# EAGLE design motor6 (EAGLE 6.1)

## Sheet 1 of 3
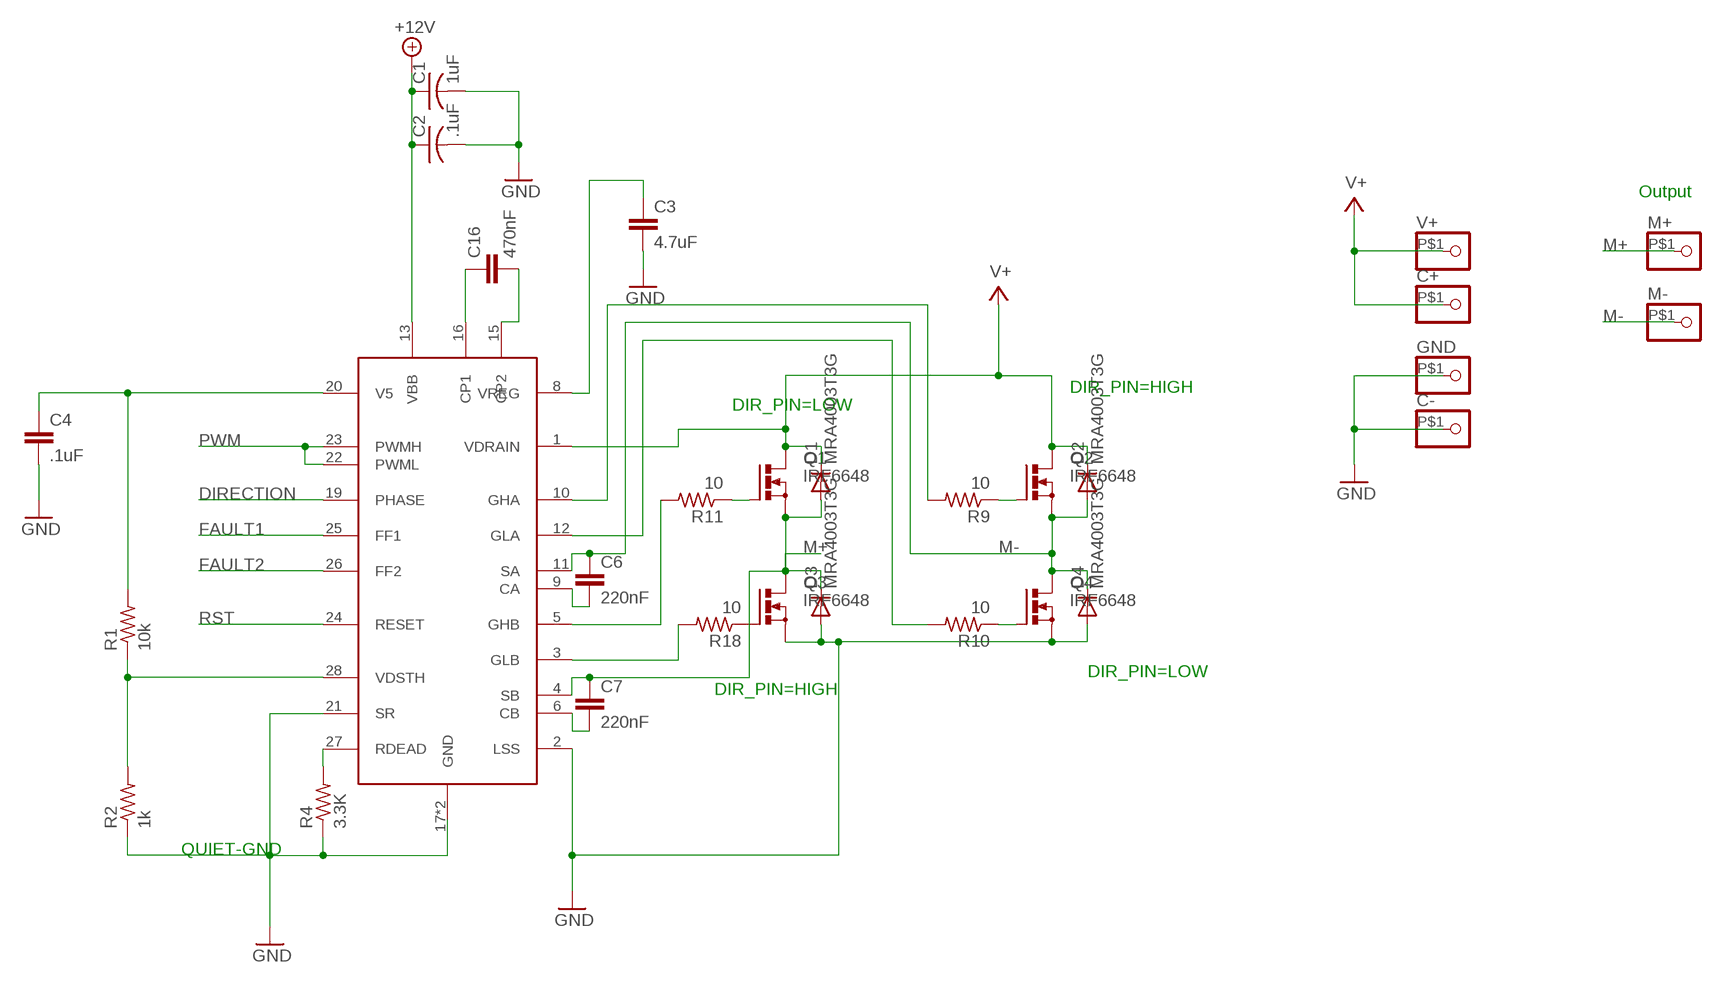
[diagram p0: schematic, sheet 1]

### Parts
ALLGR  ALLEGRO-A3921  [TSSOP28]
C1  1uF  C-USC0603  [C0603]
C2  .1uF  C-USC0603  [C0603]
C3  4.7uF  C-EUC0603  [C0603]
C4  .1uF  C-EUC0603  [C0603]
C6  220nF  C-EUC0603  [C0603]
C7  220nF  C-EUC0603  [C0603]
C16  470nF  C-EUC0603  [C0603]
C+  PINHD-1X1  [1X01]
C-  PINHD-1X1  [1X01]
D1  MRA4003T3G  [SMA]
D2  MRA4003T3G  [SMA]
D3  MRA4003T3G  [SMA]
D4  MRA4003T3G  [SMA]
GND  PINHD-1X1  [1X01]
M+  PINHD-1X1  [1X01]
M-  PINHD-1X1  [1X01]
Q1  IRF6648  [DIRECTFET-MOD]
Q2  IRF6648  [DIRECTFET-MOD]
Q3  IRF6648  [DIRECTFET]
Q4  IRF6648  [DIRECTFET]
R1  10k  R-US_R0603  [R0603]
R2  1k  R-US_R0603  [R0603]
R4  3.3K  R-US_R0603  [R0603]
R9  10  R-US_R0603  [R0603]
R10  10  R-US_R0603  [R0603]
R11  10  R-US_R0603  [R0603]
R18  10  R-US_R0603  [R0603]
V+  PINHD-1X1  [1X01]

### Nets
+5V-A: ALLGR.20(V5) C4.1 R1.2
+12V: ALLGR.13(VBB) C1.1 C2.1 ; also sheet 3
+48V: ALLGR.1(VDRAIN) C+.P$1 D1.C D2.C Q1.D@1(D) Q1.D@2(D) Q1.D@3(D) Q1.D@4(D) Q2.D@1(D) Q2.D@2(D) Q2.D@3(D) Q2.D@4(D) V+.P$1 ; supply symbol labelled V+ ; also sheet 3
DIRECTION: ALLGR.19(PHASE) ; also sheet 2
FAULT1: ALLGR.25(FF1) ; also sheet 2
FAULT2: ALLGR.26(FF2) ; also sheet 2
GND: ALLGR.2(LSS) ALLGR.17(GND) ALLGR.21(SR) ALLGR.P$1(GND) C1.2 C2.2 C3.2 C4.2 C-.P$1 D3.A D4.A GND.P$1 Q3.S@1(S) Q3.S@2(S) Q4.S@1(S) Q4.S@2(S) R2.1 R4.1 ; also sheet 2,3
M+: ALLGR.4(SB) C7.1 D1.A D3.C M+.P$1 Q1.S@1(S) Q1.S@2(S) Q3.D@1(D) Q3.D@2(D) Q3.D@3(D) Q3.D@4(D)
M-: ALLGR.11(SA) C6.1 D2.A D4.C M-.P$1 Q2.S@1(S) Q2.S@2(S) Q4.D@1(D) Q4.D@2(D) Q4.D@3(D) Q4.D@4(D)
N$1: ALLGR.8(VREG) C3.1
N$2: ALLGR.16(CP1) C16.1
N$3: ALLGR.15(CP2) C16.2
N$4: ALLGR.10(GHA) R9.2
N$6: ALLGR.5(GHB) R11.2
N$7: Q1.G R11.1
N$11: ALLGR.6(CB) C7.2
N$12: ALLGR.9(CA) C6.2
N$13: ALLGR.28(VDSTH) R1.1 R2.2
N$20: ALLGR.27(RDEAD) R4.2
N$21: Q3.G R18.1
N$29: Q2.G R9.1
N$30: Q4.G R10.1
N$31: ALLGR.12(GLA) R10.2
N$32: ALLGR.3(GLB) R18.2
PWM: ALLGR.22(PWML) ALLGR.23(PWMH) ; also sheet 2
RST: ALLGR.24(RESET) ; also sheet 2

### Notes on the sheet
- Output
- DIR_PIN=HIGH
- DIR_PIN=LOW
- DIR_PIN=LOW
- DIR_PIN=HIGH
- QUIET-GND

## Sheet 2 of 3
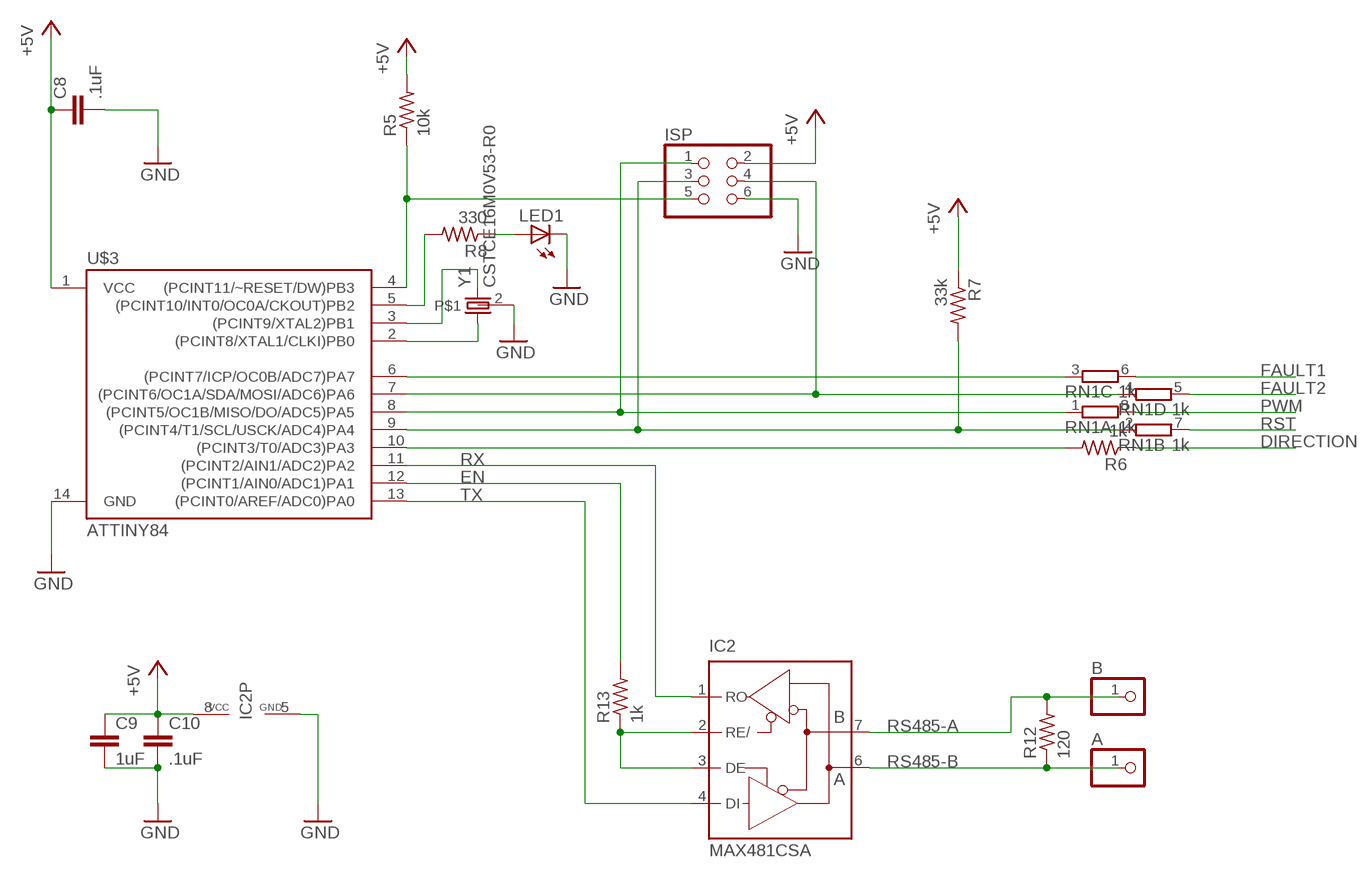
[diagram p1: schematic, sheet 2]

### Parts
A  PINHD-1X1  [1X01]
B  PINHD-1X1  [1X01]
C8  .1uF  C-EUC0603  [C0603]
C9  1uF  C-EUC0603  [C0603]
C10  .1uF  C-EUC0603  [C0603]
IC2  MAX481CSA  [SO08]
ISP  PINHD-2X3  [2X03]
LED1  LEDCHIPLED_0603  [CHIPLED_0603]
R5  10k  R-US_R0603  [R0603]
R6  1k  R-US_R0603  [R0603]
R7  33k  R-US_R0603  [R0603]
R8  330  R-US_R0603  [R0603]
R12  120  R-US_R0603  [R0603]
R13  1k  R-US_R0603  [R0603]
RN1  1k  4R-NEXB38V  [EXB38V]
U$3  ATTINY84  [SO14]
Y1  CSTCE16M0V53-R0  [MYSMD2_RESONATOR]

### Nets
+5V: C8.1 C9.1 C10.1 IC2.8(VCC) ISP.2 R5.2 R7.1 U$3.1(VCC) ; also sheet 3
DIRECTION: R6.1 ; also sheet 1
EN: R13.2 U$3.12((PCINT1/AIN0/ADC1)PA1)
FAULT1: RN1.6 ; also sheet 1
FAULT2: RN1.5 ; also sheet 1
GND: C8.2 C9.2 C10.2 IC2.5(GND) ISP.6 LED1.C U$3.14(GND) Y1.2 ; also sheet 1,3
N$5: ISP.1 RN1.1 U$3.8((PCINT5/OC1B/MISO/DO/ADC5)PA5)
N$8: ISP.4 RN1.4 U$3.7((PCINT6/OC1A/SDA/MOSI/ADC6)PA6)
N$14: IC2.2(RE/) IC2.3(DE) R13.1
N$16: U$3.2((PCINT8/XTAL1/CLKI)PB0) Y1.1
N$18: RN1.3 U$3.6((PCINT7/ICP/OC0B/ADC7)PA7)
N$19: R6.2 U$3.10((PCINT3/T0/ADC3)PA3)
N$24: U$3.3((PCINT9/XTAL2)PB1) Y1.3
N$26: LED1.A R8.1
N$28: R8.2 U$3.5((PCINT10/INT0/OC0A/CKOUT)PB2)
N$33: ISP.5 R5.1 U$3.4((PCINT11/~RESET/DW)PB3)
OIJWOIJ3: ISP.3 R7.2 RN1.2 U$3.9((PCINT4/T1/SCL/USCK/ADC4)PA4)
PWM: RN1.8 ; also sheet 1
RS485-A: B.1 IC2.7(B) R12.2
RS485-B: A.1 IC2.6(A) R12.1
RST: RN1.7 ; also sheet 1
RX: IC2.1(RO) U$3.11((PCINT2/AIN1/ADC2)PA2)
TX: IC2.4(DI) U$3.13((PCINT0/AREF/ADC0)PA0)

## Sheet 3 of 3
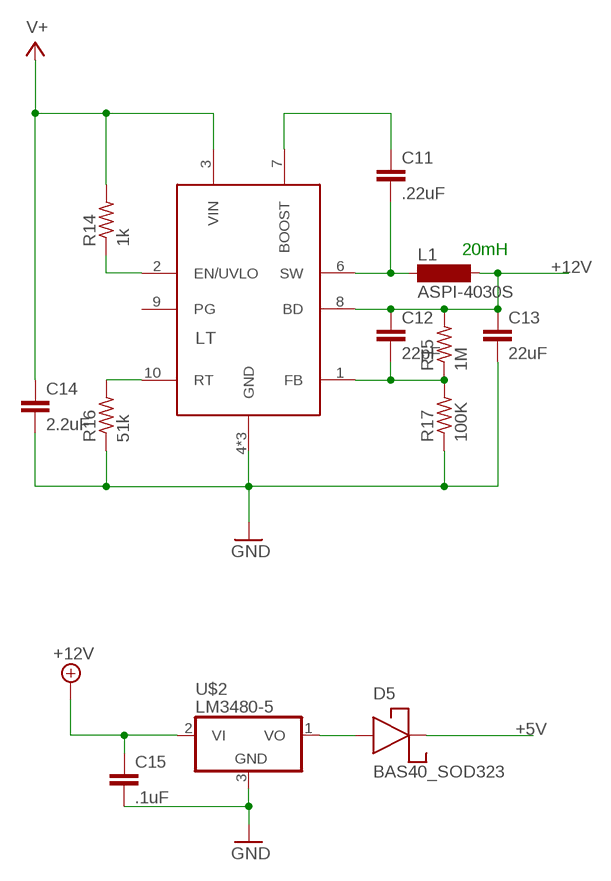
[diagram p2: schematic, sheet 3]

### Parts
C11  .22uF  C-EUC0603  [C0603]
C12  22pF  C-EUC0603  [C0603]
C13  22uF  C-EUC0805  [C0805]
C14  2.2uF  C-EUC0603  [C0603]
C15  .1uF  C-EUC0603  [C0603]
D5  BAS40_SOD323  [SOD323]
L1  ASPI-4030S  [ASPI-4030S]
LT  LT3990  [DFN10-3X3]
R14  1k  R-US_R0603  [R0603]
R15  1M  R-US_R0603  [R0603]
R16  51k  R-US_R0603  [R0603]
R17  100K  R-US_R0603  [R0603]
U$2  LM3480-5  [SOT23]

### Nets
+5V: D5.1 ; also sheet 2
+12V: C12.1 C13.1 C15.1 L1.P$2 LT.8(BD) R15.2 U$2.2(VI) ; also sheet 1
+48V: C14.1 LT.3(VIN) R14.2 ; supply symbol labelled V+ ; also sheet 1
GND: C13.2 C14.2 C15.2 LT.4(GND) LT.5(GND) LT.EXP(GND) R16.1 R17.1 U$2.3(GND) ; also sheet 1,2
N$10: C11.1 LT.7(BOOST)
N$15: C11.2 L1.P$1 LT.6(SW)
N$17: C12.2 LT.1(FB) R15.1 R17.2
N$22: LT.10(RT) R16.2
N$25: D5.2 U$2.1(VO)
N$27: LT.2(EN/UVLO) R14.1
Unconnected: LT.9(PG)

### Notes on the sheet
- 20mH

## Library data of the parts
A B = pinhead:PINHD-1X1: PIN HEADER
ALLGR = evan:ALLEGRO-A3921: Allegro A3921 Automotive Full Bridge Mosfet Driver
C1 C2 = rcl:C-US: CAPACITOR, American symbol
C3 C4 C6-C16 = rcl:C-EU: CAPACITOR, European symbol
C+ C- GND M+ M- V+ = evan:PINHD-1X1: PIN HEADER
D1-D4 = evan:MRA4003T3G
D5 = evan:BAS40_SOD323
IC2 = maxim:MAX481CSA: RS485 TRANSEIVER; MF: MAXIM; MPN: MAX481CSA; OC_FARNELL: unknown; OC_NEWARK: 90C3817
ISP = pinhead:PINHD-2X3: PIN HEADER
L1 = evan:ASPI-4030S
LED1 = led:LED: LED OSRAM: - CHIPLED LG R971, LG N971, LY N971, LG Q971, LY Q971, LO R971, LY R971 LH N974, LH R974 LS Q976, LO Q976, LY Q976 LO Q996 - Hyper CHIPLED LW Q18S LB Q993, LB Q99A, LB R99A - SideLED LS A670, LO A670, LY A670, LG A670, LP A670 LB A673, LV A673, LT A673, LW A673 LH A674 LY A675 LS A676, LA A676, LO A676, LY A676, LW A676 LS A679, LY A679, LG A679 - Hyper Micro SIDELED® LS Y876, LA Y876, LO Y876, LY Y876 LT Y87S - SmartLED LW L88C, LW L88S LB L89C, LB L89S, LG L890 LS L89K, LO L89K, LY L89K LS L896, LA L896, LO L896, LY L896 - TOPLED LS T670, LO T670, LY T670, LG T670, LP T670 LSG T670, LSP T670, LSY T670, LOP T670, LYG T670 LG T671, LOG T671, LSG T671 LB T673, LV T673, LT T673, LW T673 LH T674 LS T676, LA T676, LO T676, LY T676, LB T676, LH T676, LSB T676, LW T676 LB T67C, LV T67C, LT T67C, LS T67K, LO T67K, LY T67K, LW E67C LS E67B, LA E67B, LO E67B, LY E67B, LB E67C, LV E67C, LT E67C LW T67C LS T679, LY T679, LG T679 LS T770, LO T770, LY T770, LG T770, LP T770 LB T773, LV T773, LT T773, LW T773 LH T774 LS E675, LA E675, LY E675, LS T675 LS T776, LA T776, LO T776, LY T776, LB T776 LHGB T686 LT T68C, LB T68C - Hyper Mini TOPLED® LB M676 - Mini TOPLED Santana® LG M470 LS M47K, LO M47K, LY M47K Source: http://www.osram.convergy.de LUXEON: - LUMILED® LXK2-PW12-R00, LXK2-PW12-S00, LXK2-PW14-U00, LXK2-PW14-V00 LXK2-PM12-R00, LXK2-PM12-S00, LXK2-PM14-U00 LXK2-PE12-Q00, LXK2-PE12-R00, LXK2-PE12-S00, LXK2-PE14-T00, LXK2-PE14-U00 LXK2-PB12-K00, LXK2-PB12-L00, LXK2-PB12-M00, LXK2-PB14-N00, LXK2-PB14-P00, LXK2-PB14-Q00 LXK2-PR12-L00, LXK2-PR12-M00, LXK2-PR14-Q00, LXK2-PR14-R00 LXK2-PD12-Q00, LXK2-PD12-R00, LXK2-PD12-S00 LXK2-PH12-R00, LXK2-PH12-S00 LXK2-PL12-P00, LXK2-PL12-Q00, LXK2-PL12-R00 Source: www.luxeon.com KINGBRIGHT: KA-3528ASYC Source: www.kingbright.com
LT = evan:LT3990: http://cds.linear.com/docs/en/datasheet/3990fa.pdf
Q1 Q2 = evan:IRF6648: DirectFET Power MOSFET Source: http://www.irf.com/product-info/datasheets/data/irf6648.pdf
Q3 Q4 = transistor-power:IRF6648: DirectFET Power MOSFET Source: http://www.irf.com/product-info/datasheets/data/irf6648.pdf
R1 R2 R4-R18 = rcl:R-US_: RESISTOR, American symbol
RN1 = resistor-dil:4R-N: Array Chip Resistor Source: RS Component / Phycomp; OC_FARNELL: unknown; OC_NEWARK: unknown
U$2 = evan:LM3480-5
U$3 = evan:ATTINY84: Atmel 14-pin 2/4/8kB flash uC
Y1 = evan:CSTCE16M0V53-R0

## Board
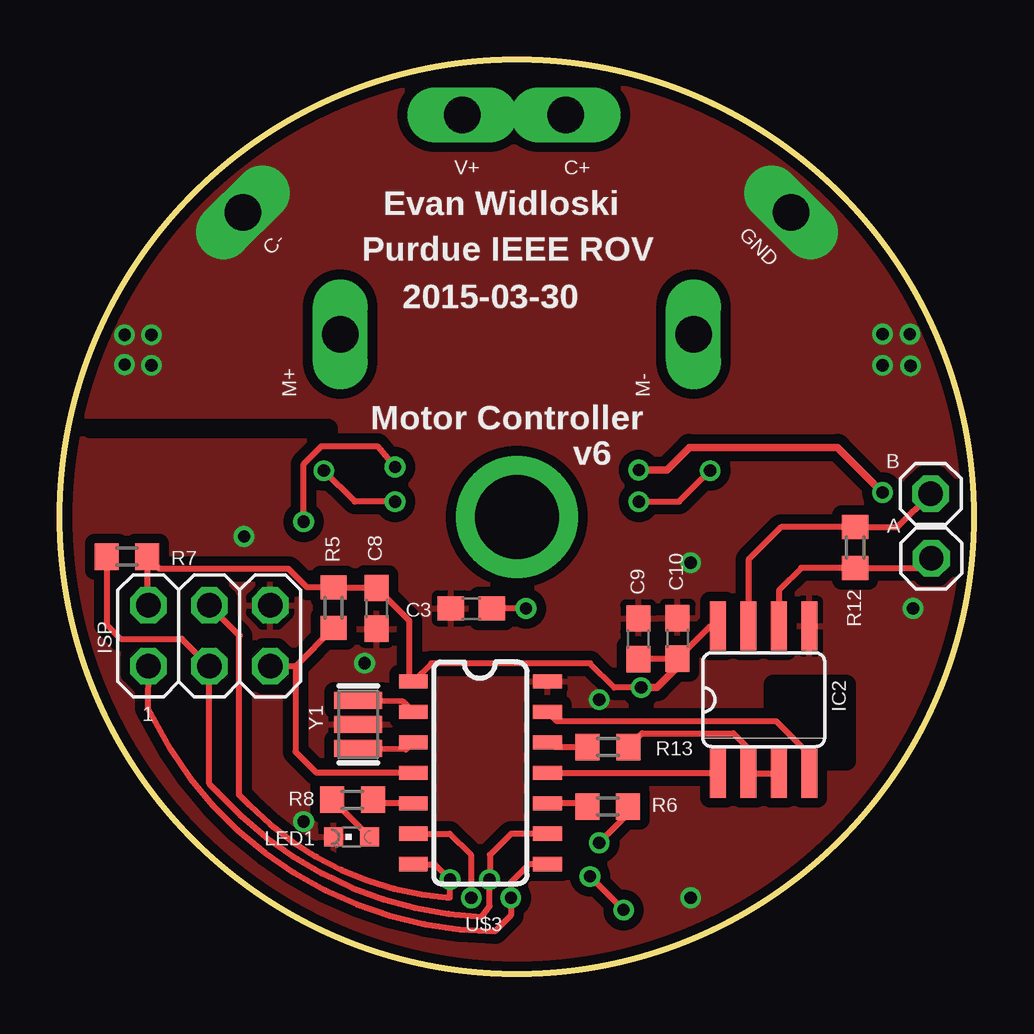
[diagram p3: board, top side]
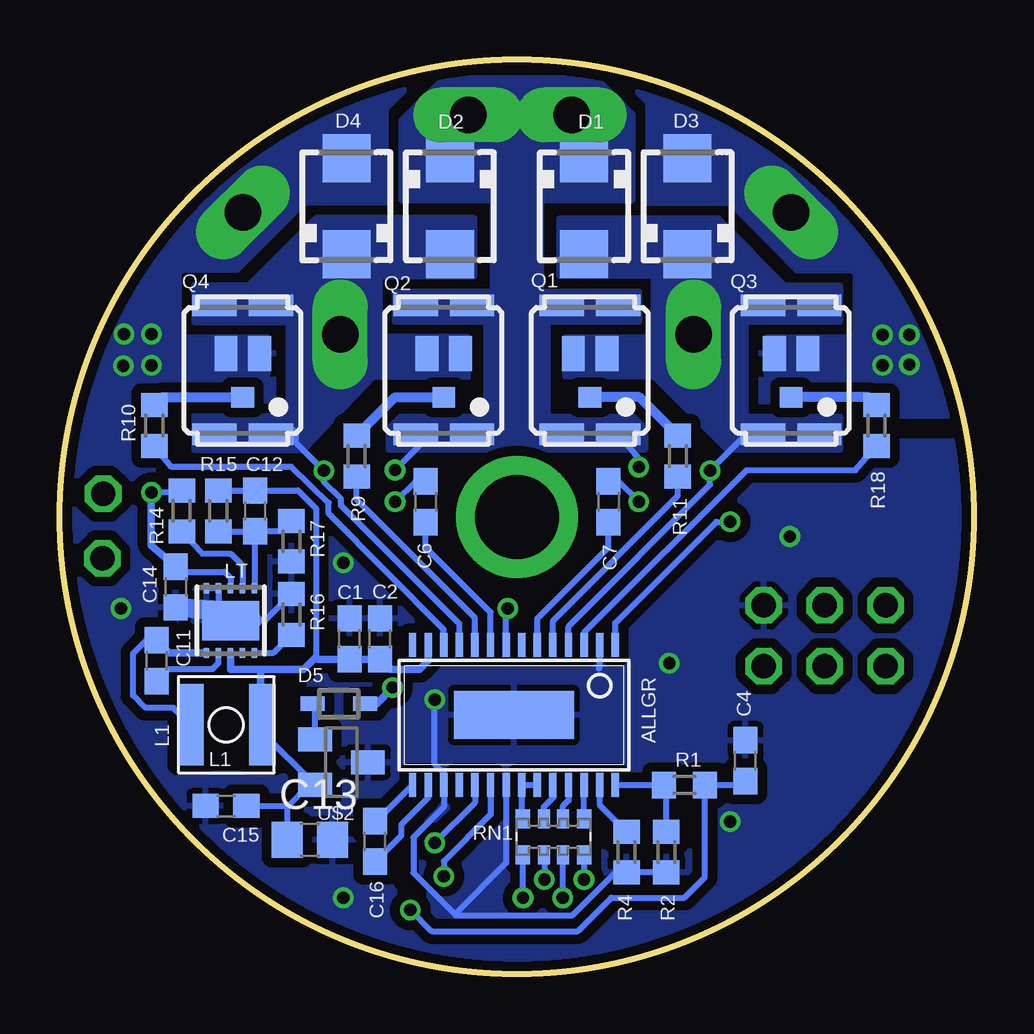
[diagram p4: board, bottom side, seen from below]

Size 38.1 x 38.1 mm. Coordinates in mm from the lower left corner, seen from the top.
Outline: circle at 19.05,19.05 radius 19.05
Copper layers (1*16): Top 0.0356mm / dielectric 1.5011mm / Bottom 0.0356mm
Design rules: minimum track width 6mil, minimum drill 13mil, track to track 6mil, track to pad 6mil, pad to pad 6mil, via to via 6mil, smd to smd 6mil, copper to edge 15mil, drill to drill 6mil, minimum pad ring 7mil, minimum via ring 7mil, stop-mask expansion 3mil, vias tented up to drill 0mil, thermal gap 10mil
tRestrict: area 29.7,8.9 to 32.8,12.1; 1 lines
bRestrict: area 29.7,8.9 to 32.8,12.1; 3 lines

### Footprints (pad centres in the part's own frame; a part is rotated, then mirrored left to right if it is on the bottom)
1X01 = drill 1.016 octagon: 1 0,0
TSSOP28 = smd 0.305 x 0.991: 1 -4.225,-2.918; 2 -3.575,-2.918; 3 -2.925,-2.918; 4 -2.275,-2.918; 5 -1.625,-2.918; 6 -0.975,-2.918; 7 -0.325,-2.918; 8 0.325,-2.918; 9 0.975,-2.918; 10 1.625,-2.918; 11 2.275,-2.918; 12 2.925,-2.918; 13 3.575,-2.918; 14 4.225,-2.918; 15 4.225,2.918; 16 3.575,2.918; 17 2.925,2.918; 18 2.275,2.918; 19 1.625,2.918; 20 0.975,2.918; 21 0.325,2.918; 22 -0.325,2.918; 23 -0.975,2.918; 24 -1.625,2.918; 25 -2.275,2.918; 26 -2.925,2.918; 27 -3.575,2.918; 28 -4.225,2.918 | smd 5 x 2: P$1 0,0
C0603 = smd 1.1 x 1: 1 -0.85,0; 2 0.85,0
C0805 = smd 1.3 x 1.5: 1 -0.95,0; 2 0.95,0
1X01' = drill 1.524 pad 1.676 long: P$1 0,0
SMA = smd 2 x 2: A 2,0; C -2,0
SOD323 = smd 1 x 0.6: 1 -1.1,0; 2 1.1,0
SO08 = smd 0.66 x 2.032: 1 -1.905,-3.073; 2 -0.635,-3.073; 3 0.635,-3.073; 4 1.905,-3.073; 5 1.905,3.073; 6 0.635,3.073; 7 -0.635,3.073; 8 -1.905,3.073
2X03 = drill 1.016 octagon: 1 -2.54,-1.27; 2 -2.54,1.27; 3 0,-1.27; 4 0,1.27; 5 2.54,-1.27; 6 2.54,1.27
ASPI-4030S = smd 1.1 x 3.4: P$1 -1.5,0; P$2 1.5,0
CHIPLED_0603 = smd 0.8 x 0.8: A 0,-0.75; C 0,0.75
DFN10-3X3 = smd 0.25 x 0.45: 1 -1,-1.35; 2 -0.5,-1.35; 3 0,-1.35; 4 0.5,-1.35; 5 1,-1.35; 6 1,1.35; 7 0.5,1.35; 8 0,1.35; 9 -0.5,1.35; 10 -1,1.35 | smd 2.38 x 1.65: EXP 0,0
DIRECTFET-MOD = smd 0.9 x 1.85: D@1 -2.656,1.176; D@2 -2.656,-1.174; D@3 2.724,1.176; D@4 2.724,-1.174 | smd 0.85 x 0.95: G -1.101,0.002 | smd 1.45 x 0.95: S@1 0.719,0.701; S@2 0.719,-0.699
R0603 = smd 1 x 1.1: 1 -0.85,0; 2 0.85,0
EXB38V = smd 0.6 x 0.8: 1 -1.275,-0.75; 4 1.275,-0.75; 5 1.275,0.75; 8 -1.275,0.75 | smd 0.5 x 0.8: 2 -0.4,-0.75; 3 0.4,-0.75; 6 0.4,0.75; 7 -0.4,0.75
SOT23 = smd 1 x 1.4: 1 -0.95,-1.1; 2 0.95,-1.1; 3 0,1.1
SO14 = smd 0.6 x 1.2: 1 -3.81,-2.8; 2 -2.54,-2.8; 3 -1.27,-2.8; 4 0,-2.8; 5 1.27,-2.8; 6 2.54,-2.8; 7 3.81,-2.8; 8 3.81,2.8; 9 2.54,2.8; 10 1.27,2.8; 11 0,2.8; 12 -1.27,2.8; 13 -2.54,2.8; 14 -3.81,2.8
MYSMD2_RESONATOR = smd 0.7 x 2: 1 -1,0; 2 0,0; 3 1,0

### Placement (x,y rotation side)
A  36.32,17.32 0 top
ALLGR  19.18,10.79 180 bottom
B  36.3,20.02 0 top
C1  26.04,13.97 90 bottom
C2  24.77,13.97 90 bottom
C3  17.14,15.24 180 top
C4  9.53,8.89 90 bottom
C6  22.86,19.69 270 bottom
C7  15.24,19.69 270 bottom
C8  13.19,15.24 270 top
C9  24.11,13.97 90 top
C10  25.75,13.99 90 top
C11  34.06,13.06 90 bottom
C12  29.97,19.3 270 bottom
C13  27.69,5.59 0 bottom
C14  33.27,16.13 270 bottom
C15  31.18,7 180 bottom
C16  24.96,5.53 90 bottom
C+  [1X01']  21.08,35.81 0 top
C-  [1X01']  7.62,31.75 45 top
D1  16.26,32 270 bottom
D2  21.84,32 270 bottom
D3  11.94,32 90 bottom
D4  26.16,32 90 bottom
D5  26.48,11.26 180 bottom
GND  [1X01']  30.48,31.75 135 top
IC2  29.34,11.43 0 top
ISP  6.22,14.1 0 top
L1  31.17,10.39 0 bottom
LED1  12.15,5.71 90 top
LT  30.99,14.73 180 bottom
M+  [1X01']  11.68,26.67 90 top
M-  [1X01']  26.42,26.67 90 top
Q1  16,25.15 90 bottom
Q2  22.1,25.15 90 bottom
Q3  IRF6648  [DIRECTFET-MOD]  7.62,25.15 90 bottom
Q4  IRF6648  [DIRECTFET-MOD]  30.48,25.15 90 bottom
R1  12.07,7.87 0 bottom
R2  12.83,5.08 90 bottom
R4  14.48,5.08 90 bottom
R5  11.4,15.27 90 top
R6  22.83,6.98 180 top
R7  2.79,17.4 180 top
R8  12.19,7.26 0 top
R9  25.73,21.59 270 bottom
R10  34.16,22.86 270 bottom
R11  12.34,21.59 270 bottom
R12  33.15,17.78 90 top
R13  22.84,9.46 180 top
R14  33.02,19.3 90 bottom
R15  31.5,19.3 90 bottom
R16  28.45,14.99 270 bottom
R17  28.45,18.03 90 bottom
R18  4.06,22.86 270 bottom
RN1  17.53,5.71 0 bottom
U$2  26.37,8.83 270 bottom
U$3  17.53,8.38 270 top
V+  [1X01']  16.76,35.81 0 top
Y1  12.43,10.4 270 top

### Tracks (layer width: path | path; a pad name or v marks a point on that pad's centre or on a via)
+5V  (via drill 0.51)
  Top 0.254: ISP.2 3.64,15.41 R7.1 4.15,16.89 9.53,16.89 10.3,16.12 R5.2 11.43,16.09 C8.1 14.57,14.72 14.57,12.35 U$3.1 15.49,12.95 22.1,12.95 23.11,11.94 v24.23,11.94 | C10.1 24.13,13.14 C9.1 | IC2.8 27.12,14.5 C10.1 | C10.1 25.75,12.8
  Top 0.305: 25.75,12.8 24.89,11.94 v24.23,11.94
  Bottom 0.254: D5.1 24.91,11.26
  Bottom 0.305: 24.91,11.26 v24.23,11.94
+5V-A  (via drill 0.51)
  Top 0.254: v22.1,4.06 v23.5,2.67
  Bottom 0.254: C4.1 9.69,7.87 R1.2 11.21,4.03 12.07,3.18 15.11,3.18 16.51,1.78 22.61,1.78 v23.5,2.67 | ALLGR.20 20.15,6.65 22.1,4.7 v22.1,4.06
+12V
  Bottom 0.254: R15.2 C12.1 28.18,20.15 27.43,19.41 27.43,13.21 27.34,13.12 | 24.34,12.7 C2.1 | 30.5,7.18 C15.1 28.67,7 28.64,6.97 | 28.64,6.97 27.73,7.88 U$2.2 29.67,10.08 L1.P$2 29.74,10.47 | 28.64,6.97 C13.1
  Bottom 0.305: LT.8 30.99,12.7 29.74,12.7 | 27.43,13.21 27.94,12.7 29.74,12.7 | ALLGR.13 22.75,13.06 23.11,12.7 24.34,12.7 | C2.1 C1.1 27.34,13.12 | 29.74,10.47 29.74,12.7
+48V  (via drill 0.51)
  Top 0.254: v10.16,18.85 10.16,21.26 10.9,22 13.23,22 v13.97,21.13
  Top 0.305: v24.13,21.01 25.3,21.01 26.24,21.95 32.41,21.95 v34.29,20.07
  Bottom 0.254: C14.1 33.19,16.76 31.24,16.76 30.99,16.51 LT.3 | R14.2 33.11,20.07 v34.29,20.07 | 22.92,22.21 v24.13,21.01 | ALLGR.1 14.95,14.64 10.74,18.85 v10.16,18.85 | v13.97,21.13 13.97,21.49 Q1.D@2
  Bottom 0.305: v34.29,20.07 34.29,17.87 C14.1 | Q2.D@1 22.92,22.21
  pour Bottom (isolate 0.406, rank 2, no thermals): 15.75,37.34 22.1,37.34 23.88,35.56 23.88,32.26 20.07,32.26 20.07,28.19 18.03,28.19 18.03,32.26 14.22,32.26 14.22,35.81
  pour Bottom (isolate 0.406, rank 2, no thermals): 17.78,23.24 13.72,23.24 13.72,21.84 24.38,21.84 24.38,23.24 20.32,23.24 20.32,27.18 24.13,27.18 24.13,28.45 13.97,28.45 13.97,27.18 17.78,27.18
DIRECTION  (via drill 0.51)
  Top 0.254: v22.48,5.46 23.68,6.67 R6.1
  Bottom 0.254: ALLGR.19 20.8,7.14 v22.48,5.46
EN
  Top 0.254: U$3.12 20.39,9.71 20.64,9.46 R13.2
FAULT1
  Bottom 0.254: ALLGR.25 16.9,7.23 17.14,6.99 17.14,6.48 RN1.6
FAULT2
  Bottom 0.254: RN1.5 16.25,6.72 ALLGR.26
GND  (via drill 0.51)
  Bottom 0.254: ALLGR.17 | ALLGR.17 22.1,6.96 23.37,5.69 23.37,4.22 21.64,2.49 | 21.64,2.49 21.59,2.44 16.74,2.44 14.95,4.23 R2.1 | ALLGR.17 22.1,8.38 22.48,8.76 v22.48,11.43 | LT.5 LT.4 31.49,15.23 31.41,15.15 | 29.97,14.73 29.55,14.73 R16.1 | ALLGR.2 15.6,12.77 15.65,12.73 | 19.5,5.63 ALLGR.21 19.5,4.63 21.64,2.49
  Bottom 0.61: LT.EXP 29.97,14.73
  Bottom 0.813: C14.2 31.41,15.15 LT.EXP
  other vias: 12.7,12.95 26.29,3.18 26.29,17.14 3.81,26.64 2.69,26.64 3.81,25.37 2.69,25.4 7.67,18.24 34.29,25.37 34.29,26.67 35.43,26.67 35.46,25.35 35.56,15.24 10.16,6.35
  pour Bottom (isolate 0.406, rank 2, no thermals): 33.27,26.54 29.46,26.54 29.46,24.89 33.27,24.89
  pour Bottom (isolate 0.406, rank 3): 19.05,38.1 arc-90 38.1,19.05 arc-90 19.05,0 arc-90 0,19.05 arc-90
  pour Top (isolate 0.406): 19.05,38.1 arc-90 38.1,19.05 arc-90 19.05,0 arc-90 0,19.05 arc-90
  pour Bottom (isolate 0.406, rank 2, no thermals): 8.64,26.54 4.83,26.54 4.83,24.89 8.64,24.89
  pour Bottom (no thermals): 10.29,32.77 13.34,32.77 13.34,35.43 10.29,35.43
  pour Bottom (no thermals): 24.77,32.77 27.81,32.77 27.81,35.43 24.77,35.43
  pour Top (no thermals): 6.25,30.96 6.88,30.33 7.9,30.33 8.53,30.96 8.53,32.23 7.9,32.87 6.88,32.87 6.25,32.23
  pour Bottom (no thermals): 6.25,30.96 6.88,30.33 7.9,30.33 8.53,30.96 8.53,32.23 7.9,32.87 6.88,32.87 6.25,32.23
M+  (via drill 0.51)
  Top 0.254: v11,20.98 12.29,19.69 v13.97,19.69
  Bottom 0.254: ALLGR.4 16.9,14.49 11,20.4 v11,20.98 9.5,22.48 8.66,22.48 | C7.1 14.82,20.54 v13.97,19.69
  pour Bottom (isolate 0.406, rank 2, no thermals): 5.59,21.84 10.29,21.84 13.34,24.89 17.02,24.89 17.02,26.54 13.34,26.54 13.34,29.08 17.27,29.08 17.27,31.5 10.67,31.5 7.87,28.7 5.59,28.7 5.59,27.18 9.53,27.18 9.53,23.24 5.59,23.24
M-  (via drill 0.51)
  Top 0.254: v24.13,19.69 25.81,19.69 v27.1,20.98
  Bottom 0.254: ALLGR.11 21.45,14.59 26.39,19.53 26.39,19.81 27.1,20.52 v27.1,20.98 28.27,22.15 28.27,22.55 28.45,22.73 29.62,22.73 Q4.D@2 | C6.1 23.28,20.54 v24.13,19.69
  pour Bottom (isolate 0.406, rank 2, no thermals): 32.51,21.84 27.94,21.84 25.02,24.89 21.08,24.89 21.08,26.54 24.77,26.54 24.77,29.08 20.83,29.08 20.83,31.5 27.43,31.5 30.23,28.7 32.51,28.7 32.51,27.18 28.58,27.18 28.58,23.24 32.51,23.24
N$1  (via drill 0.51)
  Top 0.254: v19.43,15.24 C3.1
  Bottom 0.254: ALLGR.8 19.5,15.17 v19.43,15.24
N$2
  Bottom 0.254: ALLGR.16 22.75,7.35 23.88,6.22 23.88,5.76 C16.1
N$3
  Bottom 0.254: ALLGR.15 24.9,6.38 C16.2
N$4
  Bottom 0.254: ALLGR.10 20.8,14.83 25.73,19.79 R9.2
N$5  (via drill 0.51)
  Top 0.254: U$3.8 19.56,4.57 18.8,3.81 v18.8,3.18 18.8,2.44 18.14,1.78 arc-57 4.6,9.37 3.66,11.07 ISP.1
  Bottom 0.254: v18.8,3.18 RN1.1
N$6
  Bottom 0.254: ALLGR.5 17.55,14.71 12.34,19.94 R11.2
N$7
  Bottom 0.406: R11.1 13.95,24.05 Q1.G
N$8  (via drill 0.51)
  Top 0.254: U$3.7 15.62,4.57 v16.26,3.94 16.26,3.18 arc-41 7.9,7.04 7.47,7.47 7.47,14.07 7.49,14.1 ISP.4
  Bottom 0.254: RN1.4 v16.26,3.94
N$9  (via drill 3.5 pad 5.08)
  other vias: 19.05,19.05
N$10
  Bottom 0.254: LT.7 31.5,12.95 31.75,12.7 33.57,12.7 C11.1
N$11
  Bottom 0.254: ALLGR.6 18.2,14.82 15.24,17.78 C7.2
N$12
  Bottom 0.254: ALLGR.9 20.15,15.07 22.86,17.78 C6.2
N$13
  Bottom 0.254: ALLGR.28 R1.1 12.83,7.79 R2.2
N$14
  Top 0.254: IC2.3 IC2.2 28.7,9.4 28.07,10.03 24.26,10.03 R13.1
N$15
  Bottom 0.254: L1.P$1 33.38,11.1 34.54,11.1 35.05,11.61 35.05,13.36 34.51,13.91 C11.2
  Bottom 0.305: LT.6 33.54,13.38 C11.2
N$16
  Top 0.254: U$3.2 14.3,11.35 Y1.1
N$17
  Bottom 0.254: R17.2 28.88,18.45 C12.2 | C12.2 29.99,18.44 LT.1 | R15.1 C12.2
N$18  (via drill 0.51)
  Top 0.254: U$3.6 16.25,5.84 RN1.3 17.13,3.32 v17.14,3.18
  Bottom 0.254: RN1.3 17.14,4.95 v17.14,3.18
N$19
  Top 0.254: R6.2 21.85,7.11 U$3.10
N$20
  Bottom 0.254: ALLGR.27 15.6,7.05 R4.2
N$21
  Bottom 0.406: R18.1 4.4,24.05 Q3.G
N$22
  Bottom 0.254: LT.10 29.2,13.38 R16.2
N$24
  Top 0.254: U$3.3 14.43,9.35 Y1.3
N$25
  Bottom 0.254: U$2.1 27.46,11.15 D5.2
N$26
  Top 0.254: R8.1 11.35,7.26 LED1.A
N$27
  Bottom 0.254: R14.1 32.16,17.53 30.99,17.53 30.49,17.03 LT.2
N$28
  Top 0.254: U$3.5 13.19,7.11 R8.2
N$29
  Bottom 0.406: R9.1 24.12,24.05 Q2.G
N$30
  Bottom 0.406: R10.1 33.83,24.05 Q4.G
N$31
  Bottom 0.254: ALLGR.12 22.1,14.36 26.9,19.2 26.9,19.63 28.45,21.13 33.46,21.13 R10.2
N$32
  Bottom 0.254: ALLGR.3 16.25,14.23 9.47,21.01 4.94,21.01 R18.2
N$33
  Top 0.254: R5.1 9.82,12.83 | 9.82,12.83 ISP.5 | U$3.4 10.69,8.38 9.82,9.26 9.82,12.83
OIJWOIJ3  (via drill 0.51)
  Top 0.254: U$3.9 18.8,5.84 RN1.2 17.93,4.08 v17.91,3.94 17.91,2.82 17.58,2.39 arc-46 6.55,7.6 6.22,7.93 ISP.3 | R7.2 1.94,14.57 2.54,13.97 5.08,13.97 ISP.3 | ISP.3 6.15,12.75
  Bottom 0.254: RN1.2 17.91,4.95 v17.91,3.94
PWM
  Bottom 0.254: ALLGR.23 ALLGR.22 18.85,6.52 RN1.8
RS485-A
  Top 0.254: IC2.7 28.7,17.27 30.06,18.63 R12.2 34.91,18.63 B.1
RS485-B
  Top 0.254: IC2.6 29.97,16 30.9,16.93 R12.1 35.93,16.93 A.1
RST
  Bottom 0.254: RN1.7 17.93,6.97 17.53,7.37 17.53,7.85 ALLGR.24
RX
  Top 0.254: IC2.1 20.35,8.36 U$3.11
TX
  Top 0.254: U$3.13 20.71,10.54 29.84,10.54 31.24,9.14 IC2.4

### Text on the board
tNames: 1
bNames: L1
_tsilk: Evan Widloski | Purdue IEEE ROV | 2015-03-30 | Motor Controller | v6